# Altium schematic sheet Sheet3.SchDoc
size A; SheetNumber: 2; SheetTotal: 6
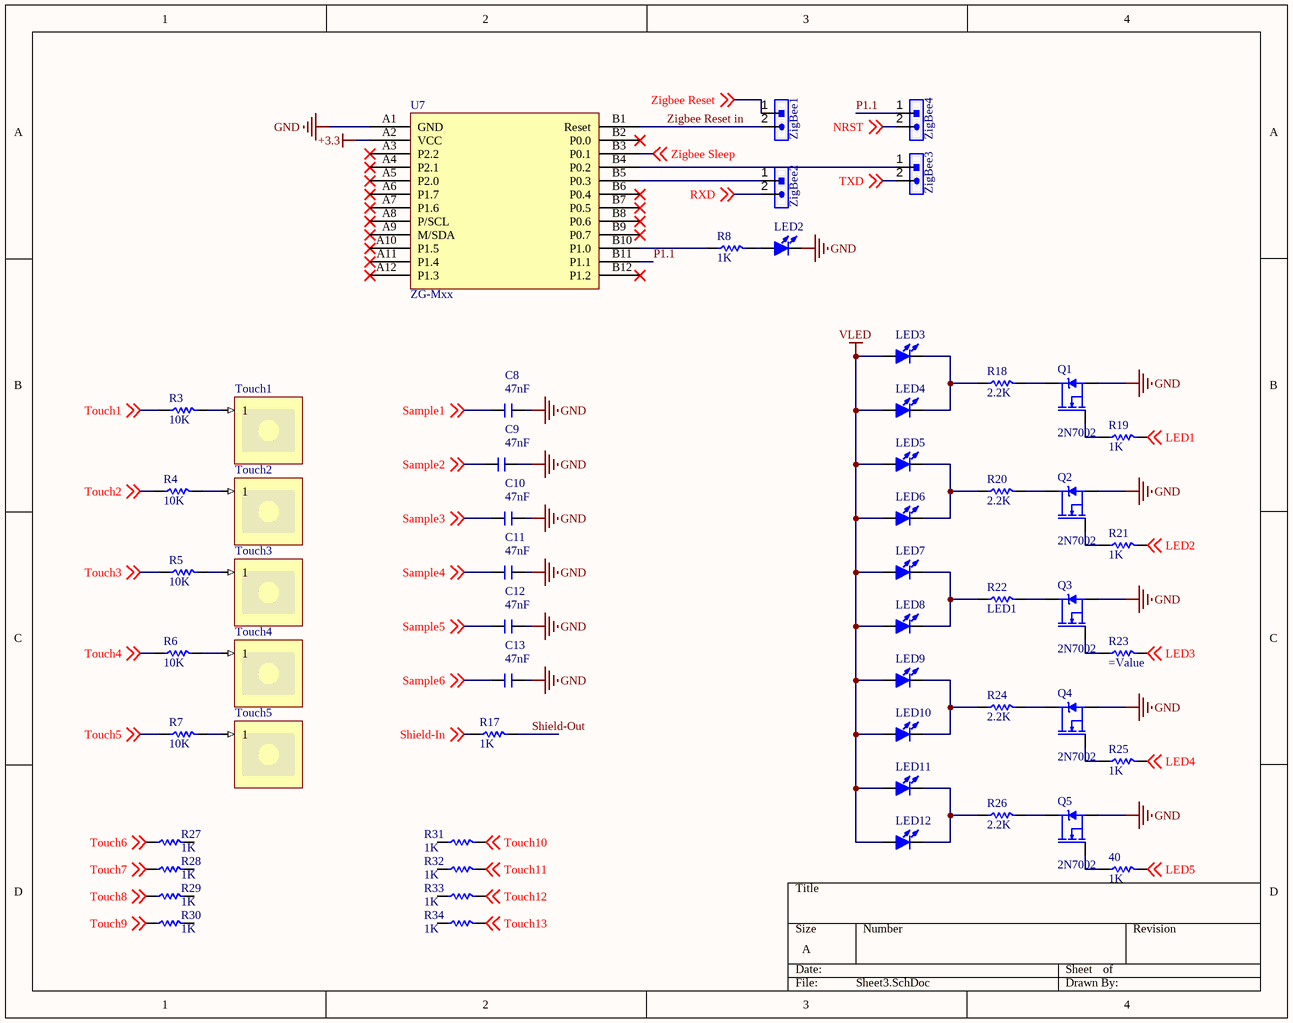
[diagram p0: Sheet3.SchDoc]

## Parts
40  1K  [R 0805]
C8  47nF  [C 0805]
C9  47nF  [C 0805]
C10  47nF  [C 0805]
C11  47nF  [C 0805]
C12  47nF  [C 0805]
C13  47nF  [C 0805]
LED2  LED-SMD  [LED 0805B]  (value not drawn)
LED3  (no value)  [LED 3MM-B]
LED4  (no value)  [LED 3MM-B]
LED5  (no value)  [LED 3MM-B]
LED6  (no value)  [LED 3MM-B]
LED7  (no value)  [LED 3MM-B]
LED8  (no value)  [LED 3MM-B]
LED9  (no value)  [LED 3MM-B]
LED10  (no value)  [LED 3MM-B]
LED11  (no value)  [LED 3MM-B]
LED12  (no value)  [LED 3MM-B]
Q1  2N7002  [SOT23-3]
Q2  2N7002  [SOT23-3]
Q3  2N7002  [SOT23-3]
Q4  2N7002  [SOT23-3]
Q5  2N7002  [SOT23-3]
R3  10K  [R 0805]
R4  10K  [R 0805]
R5  10K  [R 0805]
R6  10K  [R 0805]
R7  10K  [R 0805]
R8  1K  [R 0805]
R17  1K  [R 0805]
R18  2.2K  [R 0805]
R19  1K  [R 0805]
R20  2.2K  [R 0805]
R21  1K  [R 0805]
R22  LED1  [R 0805]
R23  (no value)  [R 0805]
R24  2.2K  [R 0805]
R25  1K  [R 0805]
R26  2.2K  [R 0805]
R27  1K  [R 0805]
R28  1K  [R 0805]
R29  1K  [R 0805]
R30  1K  [R 0805]
R31  1K  [R 0805]
R32  1K  [R 0805]
R33  1K  [R 0805]
R34  1K  [R 0805]
Touch1  CircularButton  (value not drawn)  (no BOM)
Touch2  CircularButton  (value not drawn)  (no BOM)
Touch3  CircularButton  (value not drawn)  (no BOM)
Touch4  CircularButton  (value not drawn)  (no BOM)
Touch5  CircularButton  (value not drawn)  (no BOM)
U7  ZG-Mxx  [XBee]
ZigBee1  HDR-1X2  [HDR-1X2]  (value not drawn)
ZigBee2  HDR-1X2  [HDR-1X2]  (value not drawn)
ZigBee3  HDR-1X2  [HDR-1X2]  (value not drawn)
ZigBee4  HDR-1X2  [HDR-1X2]  (value not drawn)

## Nets
+3.3: U7.A2(VCC)
GND: C8.2 C9.2 C10.2 C11.2 C12.2 C13.2 LED2.2(K) Q1.2(S) Q2.2(S) Q3.2(S) Q4.2(S) Q5.2(S) U7.A1(GND)
VLED: LED3.1(A) LED4.1(A) LED5.1(A) LED6.1(A) LED7.1(A) LED8.1(A) LED9.1(A) LED10.1(A) LED11.1(A) LED12.1(A)
LED1: R19.2 ; off-sheet LED1
LED2: R21.2 ; off-sheet LED2
LED3: R23.2 ; off-sheet LED3
LED4: R25.2 ; off-sheet LED4
LED5: 40.2 ; off-sheet LED5
NRST: ZigBee4.2 ; off-sheet NRST
P1.1: U7.B11(P1.1) ZigBee4.1
RXD: ZigBee2.2 ; off-sheet RXD
Sample1: C8.1 ; off-sheet Sample1
Sample2: C9.1 ; off-sheet Sample2
Sample3: C10.1 ; off-sheet Sample3
Sample4: C11.1 ; off-sheet Sample4
Sample5: C12.1 ; off-sheet Sample5
Sample6: C13.1 ; off-sheet Sample6
Shield-In: R17.1 ; off-sheet Shield-In
Shield-Out: R17.2
Touch1: R3.1 ; off-sheet Touch1
Touch2: R4.1 ; off-sheet Touch2
Touch3: R5.1 ; off-sheet Touch3
Touch4: R6.1 ; off-sheet Touch4
Touch5: R7.1 ; off-sheet Touch5
Touch6: R27.1 ; off-sheet Touch6
Touch7: R28.1 ; off-sheet Touch7
Touch8: R29.1 ; off-sheet Touch8
Touch9: R30.1 ; off-sheet Touch9
Touch10: R31.2 ; off-sheet Touch10
Touch11: R32.2 ; off-sheet Touch11
Touch12: R33.2 ; off-sheet Touch12
Touch13: R34.2 ; off-sheet Touch13
TXD: ZigBee3.2 ; off-sheet TXD
Zigbee Reset: ZigBee1.1 ; off-sheet Zigbee Reset
Zigbee Reset in: U7.B1(Reset) ZigBee1.2
Zigbee Sleep: U7.B3(P0.1) ; off-sheet Zigbee Sleep
Net40_1: 40.1 Q5.1(G)
NetLED2_1: LED2.1(A) R8.2
NetLED3_2: LED3.2(K) LED4.2(K) R18.1
NetLED5_2: LED5.2(K) LED6.2(K) R20.1
NetLED7_2: LED7.2(K) LED8.2(K) R22.1
NetLED9_2: LED9.2(K) LED10.2(K) R24.1
NetLED11_2: LED11.2(K) LED12.2(K) R26.1
NetQ1_1: Q1.1(G) R19.1
NetQ1_3: Q1.3(D) R18.2
NetQ2_1: Q2.1(G) R21.1
NetQ2_3: Q2.3(D) R20.2
NetQ3_1: Q3.1(G) R23.1
NetQ3_3: Q3.3(D) R22.2
NetQ4_1: Q4.1(G) R25.1
NetQ4_3: Q4.3(D) R24.2
NetQ5_3: Q5.3(D) R26.2
NetR3_2: R3.2 Touch1.1
NetR4_2: R4.2 Touch2.1
NetR5_2: R5.2 Touch3.1
NetR6_2: R6.2 Touch4.1
NetR7_2: R7.2 Touch5.1
NetR8_1: R8.1 U7.B10(P1.0)
NetU7_B4: U7.B4(P0.2) ZigBee3.1
NetU7_B5: U7.B5(P0.3) ZigBee2.1

Not connected (* = marked no-connect by the designer): R27 2; R28 2; R29 2; R30 2; R31 1; R32 1; R33 1; R34 1; U7 A3(P2.2)* A4(P2.1)* A5(P2.0)* A6(P1.7)* A7(P1.6)* A8(P/SCL)* A9(M/SDA)* A10(P1.5)* A11(P1.4)* A12(P1.3)* B2(P0.0)* B6(P0.4)* B7(P0.5)* B8(P0.6)* B9(P0.7)* B12(P1.2)*

## Library data of the parts
40 R3-R8 R17-R34 = R: Chip resistor; 版权归属: 源创客; BOM名称: Chip resistor; 学习资源: www.ooocke.com
C8-C13 = C: Non-polar patch capacitor; BOM名称: 无极性贴片电容; 版权归属: 源创客; 学习资源: www.ooocke.com
LED2 = LED-SMD: Patch LED; BOM名称: 贴片LED; 版权归属: 源创客; 学习资源: www.ooocke.com
LED3-LED12 = LED-3MM: Plug-in LED; BOM名称: 插件LED; 版权归属: 源创客; 学习资源: www.ooocke.com
Q1-Q5 = 2N7002: N-Channel 60V 115mA (Tc) 225mW (Ta) Surface Mount SOT-23-3 (TO-236); MF: STMicroelectronics; Package: SOT-23-3 Vishay; Value: *; Check_prices: https://www.snapeda.com/parts/2N7002/STMicroelectronics/view-part/2885412/?ref=eda; SnapEDA_Link: https://www.snapeda.com/parts/2N7002/STMicroelectronics/view-part/2885412/?ref=snap; Availability: Good; Price: None; MP: 2N7002; Purchase-URL: https://pricing.snapeda.com/search/part/2N7002/?ref=eda
Touch1-Touch5 = CircularButton: ConfiguratorName: CYPRESS_TOUCH; ConfigurationParameters: {}__sensorid[RectangularCurvedEdgeButton]{}width[20]{}Length[20]{}innerDiameter[0]{}
U7 = XBee
ZigBee1-ZigBee4 = Header 2: 2P Connector; BOM名称: 2P接插件; 版权归属: 源创客; 学习资源: www.ooocke.com